# Altium schematic sheet Interboard.SchDoc
size A4; SheetNumber: 1; SheetTotal: 2
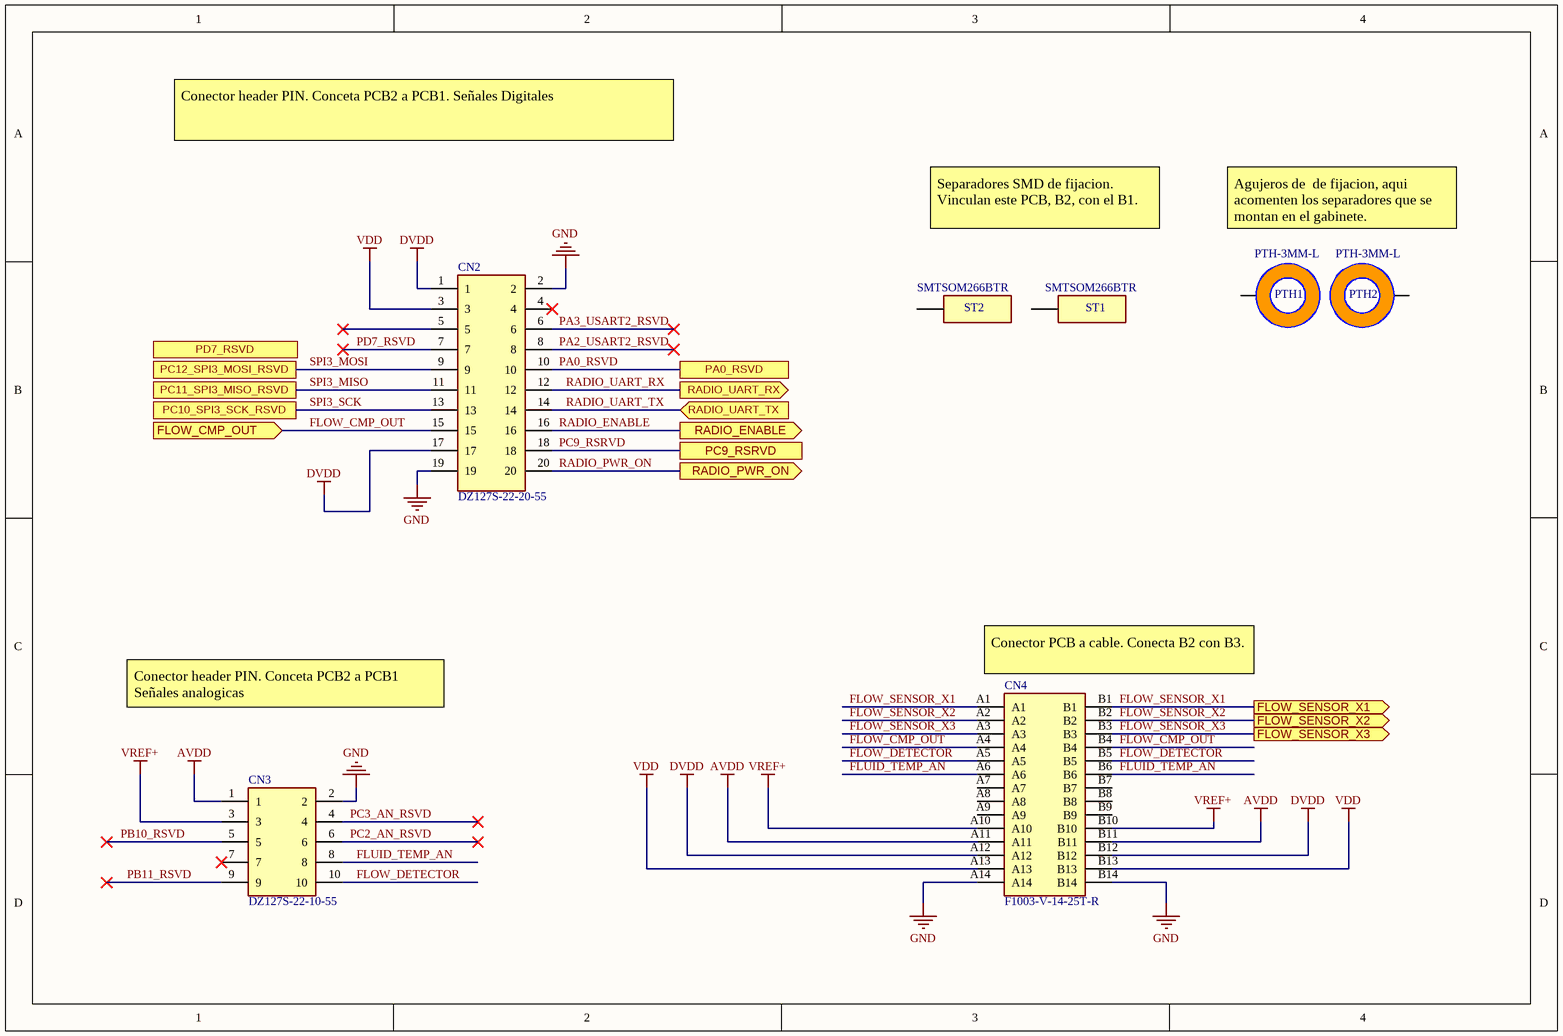
[diagram p0: Interboard.SchDoc]

## Parts
CN2  DZ127S-22-20-55  [DZ127S-22-20-55]
CN3  DZ127S-22-10-55  [DZ127S-22-10-55]
CN4  F1003-V-14-25T-R  [F1003-V-14-25T-R]
PTH1  PTH-3MM-L  [PTH_M3_L]  (no BOM)
PTH2  PTH-3MM-L  [PTH_M3_L]  (no BOM)
ST1  SMTSOM266BTR  [SMTSOM230BTR]
ST2  SMTSOM266BTR  [SMTSOM230BTR]

## Ports
FLOW_CMP_OUT (in), FLOW_SENSOR_X1 (out), FLOW_SENSOR_X2 (out), FLOW_SENSOR_X3 (out), PA0_RSVD, PC9_RSRVD, PC10_SPI3_SCK_RSVD, PC11_SPI3_MISO_RSVD, PC12_SPI3_MOSI_RSVD, PD7_RSVD, RADIO_ENABLE (out), RADIO_PWR_ON (out), RADIO_UART_RX (out), RADIO_UART_TX (in)

## Nets
AVDD: CN3.1 CN4.A11 CN4.B11
DVDD: CN2.1 CN2.17 CN4.A12 CN4.B12
GND: CN2.2 CN2.19 CN3.2 CN4.A14 CN4.B14
VDD: CN2.3 CN4.A13 CN4.B13
VREF+: CN3.3 CN4.A10 CN4.B10
FLOW_CMP_OUT: CN2.15 CN4.A4 CN4.B4 ; port FLOW_CMP_OUT
FLOW_DETECTOR: CN3.10 CN4.A5 CN4.B5
FLOW_SENSOR_X1: CN4.A1 CN4.B1 ; port FLOW_SENSOR_X1
FLOW_SENSOR_X2: CN4.A2 CN4.B2 ; port FLOW_SENSOR_X2
FLOW_SENSOR_X3: CN4.A3 CN4.B3 ; port FLOW_SENSOR_X3
FLUID_TEMP_AN: CN3.8 CN4.A6 CN4.B6
PA0_RSVD: CN2.10 ; port PA0_RSVD
PA2_USART2_RSVD: CN2.8
PA3_USART2_RSVD: CN2.6
PB10_RSVD: CN3.5
PB11_RSVD: CN3.9
PC2_AN_RSVD: CN3.6
PC3_AN_RSVD: CN3.4
PC9_RSRVD: CN2.18 ; port PC9_RSRVD
PD7_RSVD: CN2.7
RADIO_ENABLE: CN2.16 ; port RADIO_ENABLE
RADIO_PWR_ON: CN2.20 ; port RADIO_PWR_ON
RADIO_UART_RX: CN2.12 ; port RADIO_UART_RX
RADIO_UART_TX: CN2.14 ; port RADIO_UART_TX
SPI3_MISO: CN2.11 ; port PC11_SPI3_MISO_RSVD
SPI3_MOSI: CN2.9 ; port PC12_SPI3_MOSI_RSVD
SPI3_SCK: CN2.13 ; port PC10_SPI3_SCK_RSVD

Not connected (* = marked no-connect by the designer): CN2 4* 5*; CN3 7*; CN4 A7 A8 A9 B7 B8 B9; PTH1 1; PTH2 1; ST1 MH1; ST2 MH1

## Notes on the sheet
- Conector header PIN. Conceta PCB2 a PCB1. Señales Digitales
- Separadores SMD de fijacion. Vinculan este PCB, B2, con el B1.
- Agujeros de  de fijacion, aqui acomenten los separadores que se montan en el gabinete.
- Conector header PIN. Conceta PCB2 a PCB1
  Señales analogicas
- (near CN4) Conector PCB a cable. Conecta B2 con B3.

## Library data of the parts
CN2 = DZ127S-22-20-55: Header Pin SMD 1.27mm 2x10; Manufacturer_Name: SAMTEC; Manufacturer_Part_Number: SFMC-110-02-L-D; Manufacturer: Dealon; Mouser Part Number: 200-SFMC11002LD; Datasheet Link: http://suddendocs.samtec.com/prints/sfmc-1xx-xx-xx-d-xx-mkt.pdf
CN3 = DZ127S-22-10-55: Header PIN SMD 1.27mm 2x5; Manufacturer: Dealon; Manufacturer Part Number: DW127S-22-10-43
CN4 = F1003-V-14-25T-R: 14 Position FFC, FPC Connector Contacts, Vertical - 1 Sided 0.039" (1.00mm) Surface Mount; Manufacturer: XFCN; Vendor Part Number: C2764805; Vendor: LCSC; Manufacturer Part Number: F1003-V-14-25T-R
PTH1 PTH2 = PTH-3MM-L: Montaje M3. algo de holgura y buena corona.; Category: Mounting Hole; Temperature Max: -; Temperature Min: -
ST1 ST2 = SMTSOM266BTR: Standoffs & Spacers SURFACE MOUNT STANDOFF; Manufacturer: Yiyuan; Vendor: LCSC; Price: C49236522; Manufacturer Part Number: SMTSOM266BTR